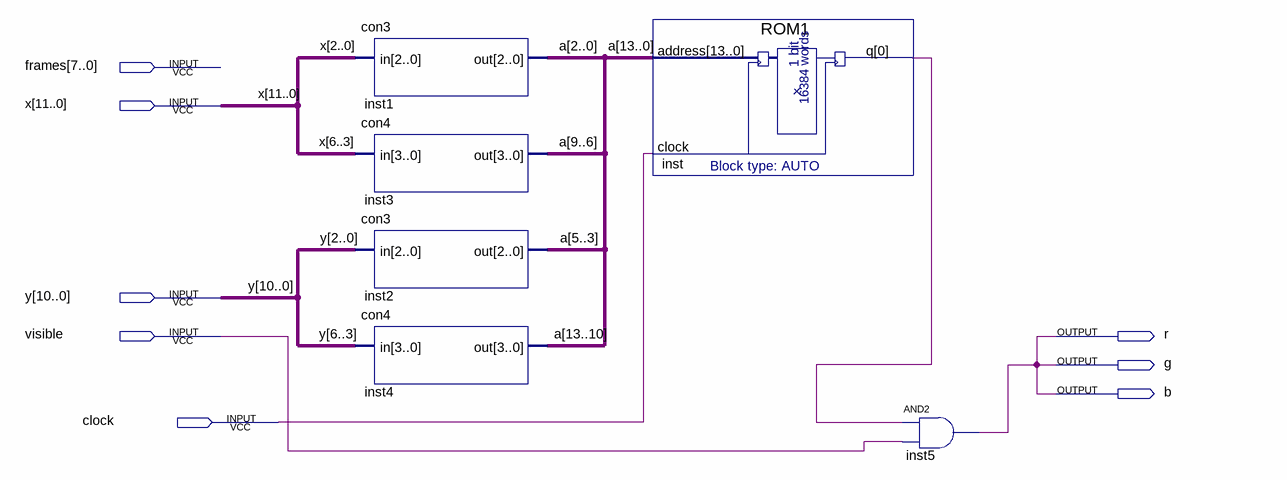
[diagram p0: schematic sheet]
// Quartus schematic code_table_1080.bdf as structural Verilog: 6 symbols, 8 pins
module code_table_1080 (
  input  [7:0] frames,
  input  [11:0] x,
  input  [10:0] y,
  input  visible,
  input  clock,
  output r,
  output g,
  output b
);

  wire inst_q;
  wire [13:0] a;

  con3 inst1 (.in(x[2:0]), .out(a[2:0]));
  con4 inst3 (.in(x[6:3]), .out(a[9:6]));
  con3 inst2 (.in(y[2:0]), .out(a[5:3]));
  con4 inst4 (.in(y[6:3]), .out(a[13:10]));
  ROM1 inst (.address(a), .clock(clock), .q(inst_q));
  and inst5 (b, inst_q, visible);

  assign g = b;
  assign r = b;
endmodule
